# Altium schematic sheet 05 Flash.SchDoc
size 420 x 297 mm
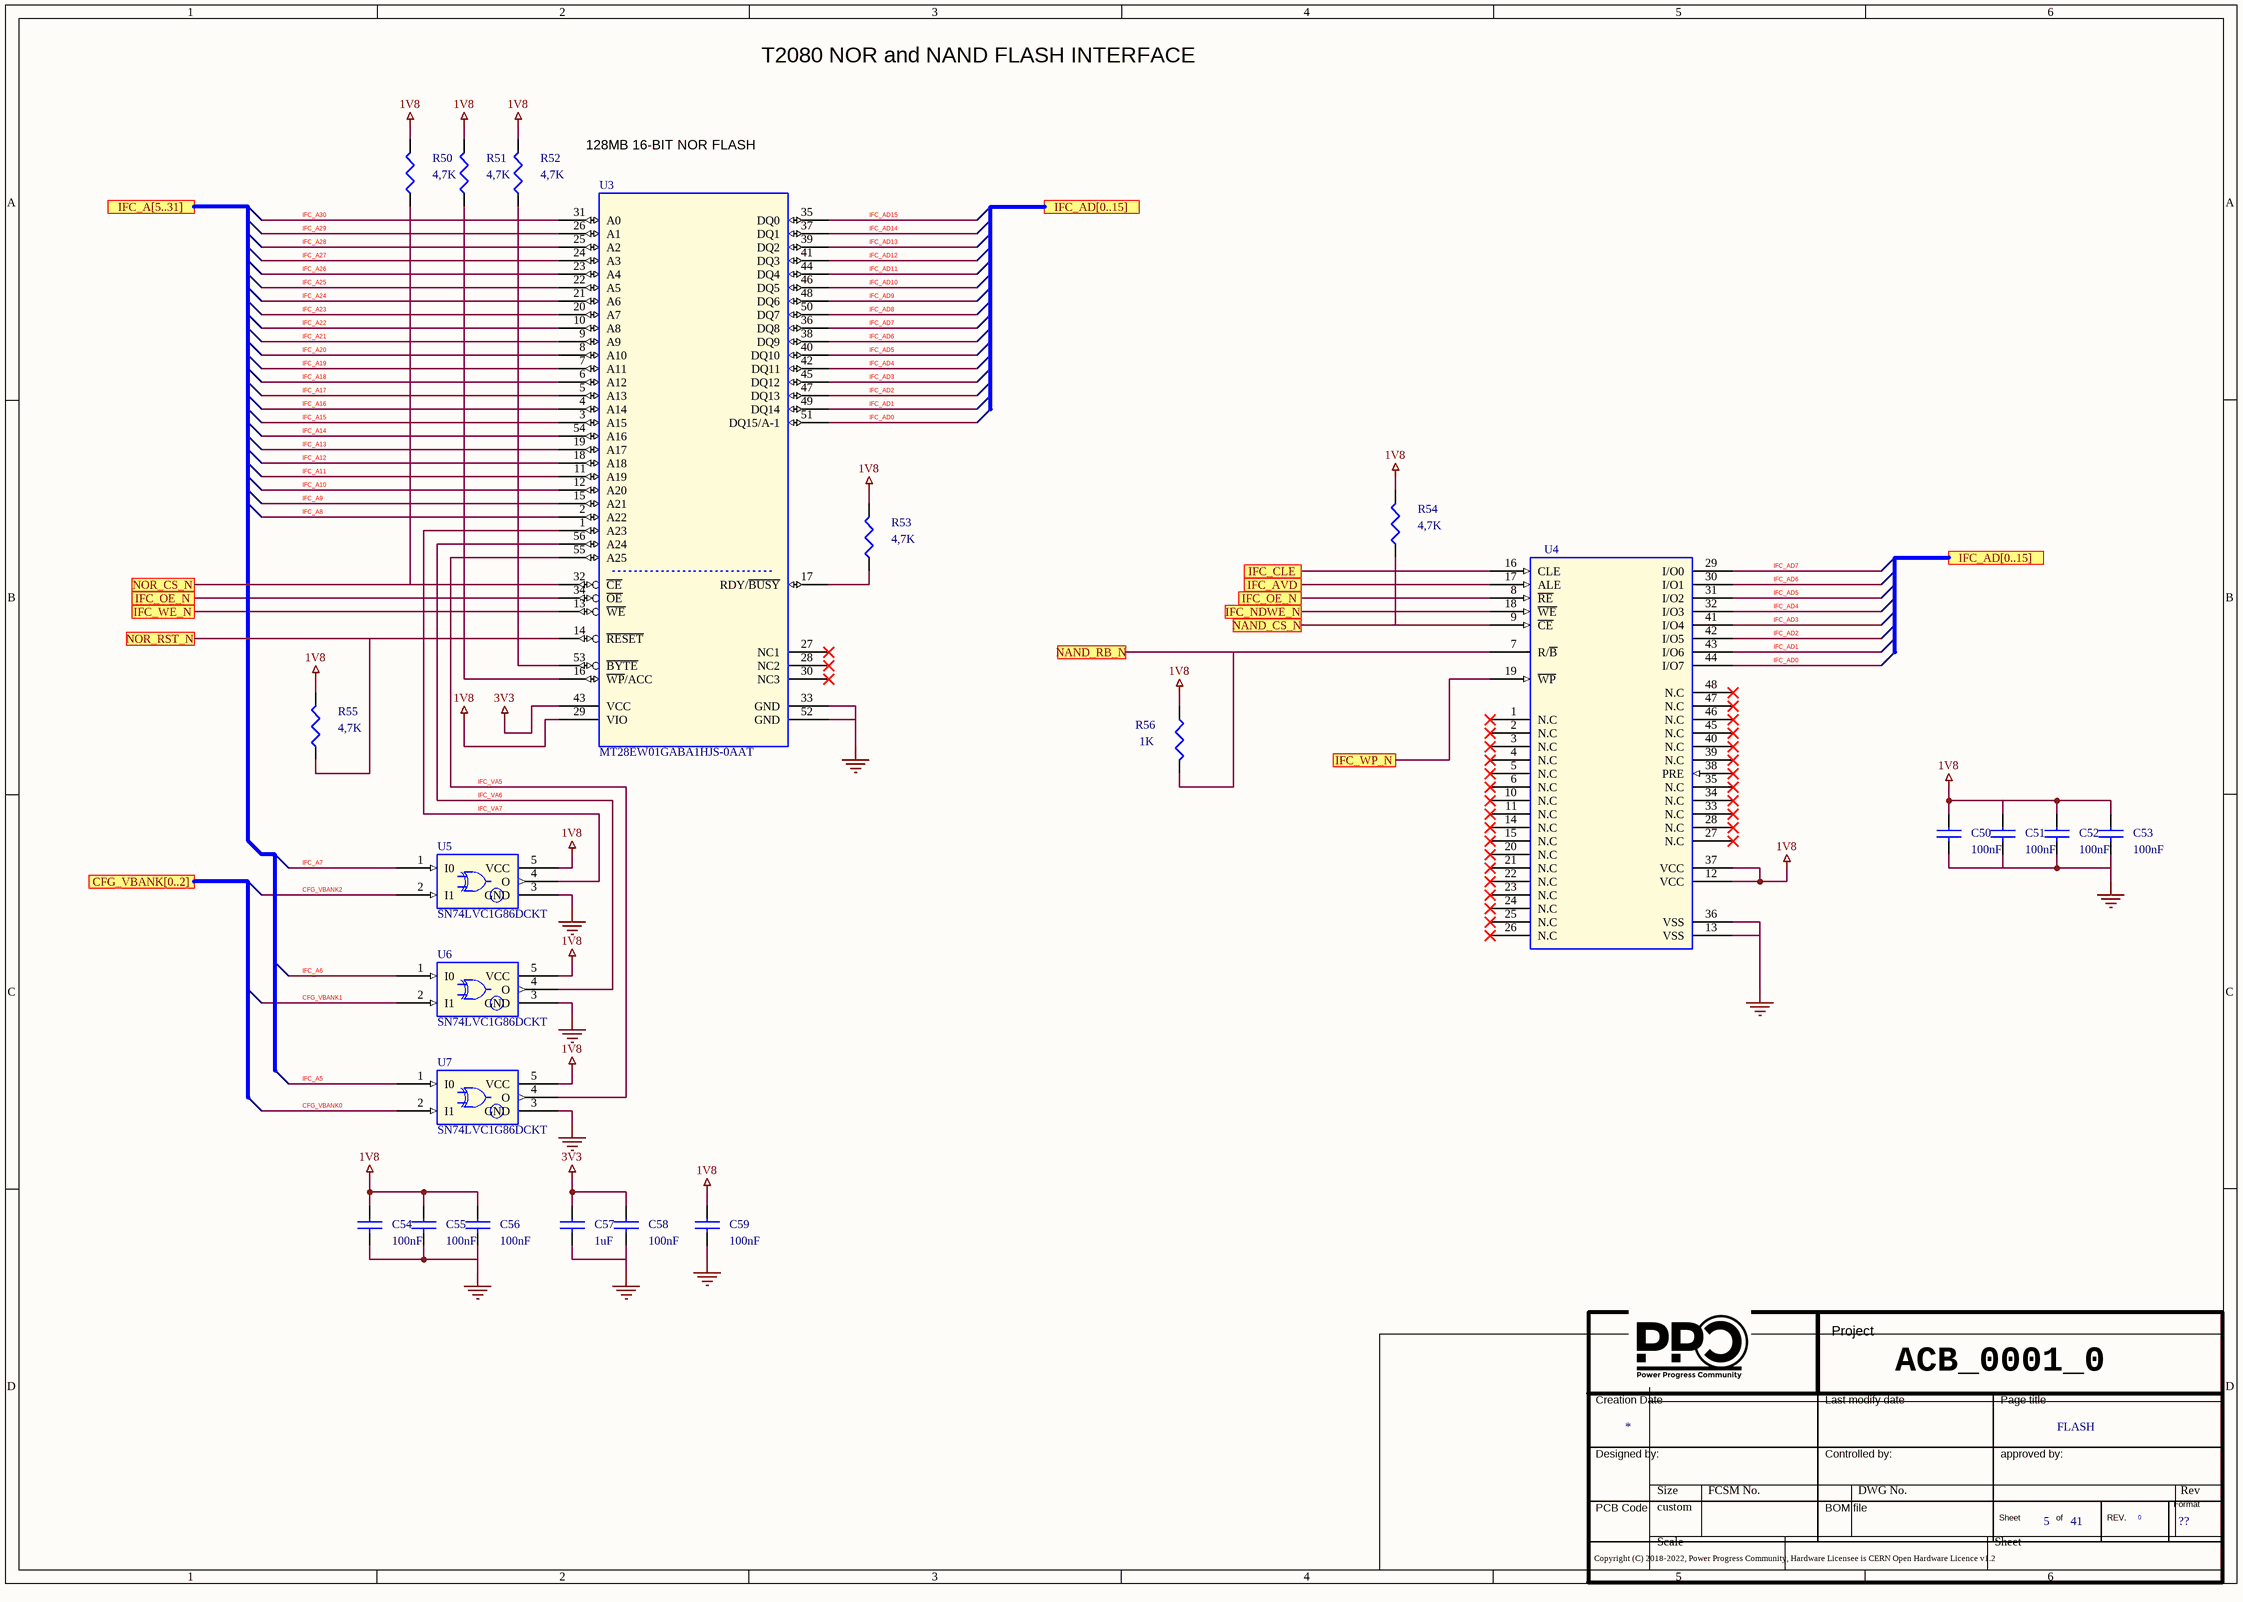
[diagram p0: 05 Flash.SchDoc]

## Parts
*  Doc: FLASH  Page Count: 41  Page Number: 5  Page Size: ??  RevCode: 0  (hidden comment: Title_block_PPC)  (graphical)
C50  100nF  [SMD_0402]
C51  100nF  [SMD_0402]
C52  100nF  [SMD_0402]
C53  100nF  [SMD_0402]
C54  100nF  [SMD_0402]
C55  100nF  [SMD_0402]
C56  100nF  [SMD_0402]
C57  1uF  [SMD_0402]
C58  100nF  [SMD_0402]
C59  100nF  [SMD_0402]
R50  4,7K  [SMD_0402]
R51  4,7K  [SMD_0402]
R52  4,7K  [SMD_0402]
R53  4,7K  [SMD_0402]
R54  4,7K  [SMD_0402]
R55  4,7K  [SMD_0402]
R56  1K  [SMD_0402]
U3  MT28EW01GABA1HJS-0AAT  [tsop1_56]
U4  MT29F4G08ABADAWP-IT:D  [TSOP_48]  (value not drawn)
U5  SN74LVC1G86DCKT  [sc70_5]
U6  SN74LVC1G86DCKT  [sc70_5]
U7  SN74LVC1G86DCKT  [sc70_5]

## Ports
CFG_VBANK[0..2], IFC_A[5..31], IFC_AD[0..15], IFC_AVD, IFC_CLE, IFC_NDWE_N, IFC_OE_N, IFC_WE_N, IFC_WP_N, NAND_CS_N, NAND_RB_N, NOR_CS_N, NOR_RST_N

## Nets
1V8: C50.1 C51.1 C52.1 C53.1 C54.1 C55.1 C56.1 C59.1 R50.2 R51.2 R52.2 R53.2 R54.2 R55.2 R56.2 U3.29(VIO) U4.12(VCC) U4.37(VCC) U5.5(VCC) U6.5(VCC) U7.5(VCC)
3V3: C57.1 C58.1 U3.43(VCC)
GND: C50.2 C51.2 C52.2 C53.2 C54.2 C55.2 C56.2 C57.2 C58.2 C59.2 U3.33(GND) U3.52(GND) U4.13(VSS) U4.36(VSS) U5.3(GND) U6.3(GND) U7.3(GND)
CFG_VBANK0: U7.2(I1)
CFG_VBANK1: U6.2(I1)
CFG_VBANK2: U5.2(I1)
IFC_A5: U7.1(I0)
IFC_A6: U6.1(I0)
IFC_A7: U5.1(I0)
IFC_A8: U3.2(A22)
IFC_A9: U3.15(A21)
IFC_A10: U3.12(A20)
IFC_A11: U3.11(A19)
IFC_A12: U3.18(A18)
IFC_A13: U3.19(A17)
IFC_A14: U3.54(A16)
IFC_A15: U3.3(A15)
IFC_A16: U3.4(A14)
IFC_A17: U3.5(A13)
IFC_A18: U3.6(A12)
IFC_A19: U3.7(A11)
IFC_A20: U3.8(A10)
IFC_A21: U3.9(A9)
IFC_A22: U3.10(A8)
IFC_A23: U3.20(A7)
IFC_A24: U3.21(A6)
IFC_A25: U3.22(A5)
IFC_A26: U3.23(A4)
IFC_A27: U3.24(A3)
IFC_A28: U3.25(A2)
IFC_A29: U3.26(A1)
IFC_A30: U3.31(A0)
IFC_AD0: U3.51(DQ15/A-1) U4.44(I/O7)
IFC_AD1: U3.49(DQ14) U4.43(I/O6)
IFC_AD2: U3.47(DQ13) U4.42(I/O5)
IFC_AD3: U3.45(DQ12) U4.41(I/O4)
IFC_AD4: U3.42(DQ11) U4.32(I/O3)
IFC_AD5: U3.40(DQ10) U4.31(I/O2)
IFC_AD6: U3.38(DQ9) U4.30(I/O1)
IFC_AD7: U3.36(DQ8) U4.29(I/O0)
IFC_AD8: U3.50(DQ7)
IFC_AD9: U3.48(DQ6)
IFC_AD10: U3.46(DQ5)
IFC_AD11: U3.44(DQ4)
IFC_AD12: U3.41(DQ3)
IFC_AD13: U3.39(DQ2)
IFC_AD14: U3.37(DQ1)
IFC_AD15: U3.35(DQ0)
IFC_AVD: U4.17(ALE) ; port IFC_AVD
IFC_CLE: U4.16(CLE) ; port IFC_CLE
IFC_NDWE_N: U4.18(~{WE}) ; port IFC_NDWE_N
IFC_OE_N: U3.34(~{OE}) U4.8(~{RE}) ; port IFC_OE_N
IFC_VA5: U3.55(A25) U7.4(O)
IFC_VA6: U3.56(A24) U6.4(O)
IFC_VA7: U3.1(A23) U5.4(O)
IFC_WE_N: U3.13(~{WE}) ; port IFC_WE_N
IFC_WP_N: U4.19(~{WP}) ; port IFC_WP_N
NAND_CS_N: R54.1 U4.9(~{CE}) ; port NAND_CS_N
NAND_RB_N: R56.1 U4.7(R/~{B}) ; port NAND_RB_N
NOR_CS_N: R50.1 U3.32(~{CE}) ; port NOR_CS_N
NOR_RST_N: R55.1 U3.14(~{RESET}) ; port NOR_RST_N
NetR51_1: R51.1 U3.16(~{WP}/ACC)
NetR52_1: R52.1 U3.53(~{BYTE})
NetR53_1: R53.1 U3.17(RDY/~{BUSY})

Not connected (* = marked no-connect by the designer): U3 27(NC1)* 28(NC2)* 30(NC3)*; U4 1(N.C)* 2(N.C)* 3(N.C)* 4(N.C)* 5(N.C)* 6(N.C)* 10(N.C)* 11(N.C)* 14(N.C)* 15(N.C)* 20(N.C)* 21(N.C)* 22(N.C)* 23(N.C)* 24(N.C)* 25(N.C)* 26(N.C)* 27(N.C)* 28(N.C)* 33(N.C)* 34(N.C)* 35(N.C)* 38(PRE)* 39(N.C)* 40(N.C)* 45(N.C)* 46(N.C)* 47(N.C)* 48(N.C)*

## Notes on the sheet
- T2080 NOR and NAND FLASH INTERFACE
- 128MB 16-BIT NOR FLASH
- ACB_0001_0
- (in symbol Title_block_PPC) Project; Creation Date; Last modify date; Page title; Designed by:; Controlled by:; approved by:; Format; PCB Code; BOM file; Sheet; of; REV.; Copyright (C) 2018-2022, Power Progress Community, Hardware Licensee is CERN Open Hardware Licence v1.2

## Library data of the parts
* = Title_block_PPC: Title: T2080PCIe; Author: MICETEK; Page Create Date: March  8, 1995; Page Title: ?; Page Modify Date: *
C50-C56 C58 C59 = CAP NP_Dup3: COND.CER. 100NF 50V 0402 X7R SMD; Part Number: PASSIVE_24; Manufacturer 1: TDK; Manufacturer Part Number 1: CGA2B3X7R1H104M050BD; RSM: RC0402; Part Type: Capacitors\Ceramic\SMD\0402; PCB Footprint: SMD_0402
C57 = CAP NP_Dup3: CAP CER 1UF 25V X6S 0402; Part Number: PASSIVE_1446; Manufacturer 1: Murata; Manufacturer Part Number 1: GRM155C81E105KE11D; RSM: RC0402; Part Type: Capacitors\Ceramic\SMD\0402; PCB Footprint: SMD_0402
R50-R55 = R_Dup6: RESIS.CHIP 4,7K 5% 0402 SMD; Manufacturer 1: ROYAL OHM; Part Number: PASSIVE_861; RSM: RC0402; Manufacturer Part Number 1: RESIS.CHIP 4,7K 5% 0402 SMD; Part Type: Resistors\Fixed\SMD\0402\5%; PCB Footprint: SMD_0402
R56 = R_Dup6: RESIS.CHIP 1K 1% 0402 SMD; Part Number: PASSIVE_628; Manufacturer 1: ROYAL OHM; RSM: RC0402; Part Type: Resistors\Fixed\SMD\0402\1%; Manufacturer Part Number 1: RESIS.CHIP 1K 1% 0402 SMD; PCB Footprint: SMD_0402
U3 = FLASH-NOR-64Mx16: NOR Flash EW-SERIES FLASH NOR SLC 64MX16 TSOP; MPN: JS28F00AM29EWHA; Part Number: MEMORIES_103; Vendor: Micron; PCB Footprint: TSOP-56; TYPE: IC; Part Type: FLASH; Manufacturer 1: Micron; Manufacturer Part Number 1: MT28EW01GABA1HJS-0AAT; Distributor 1: MOUSER(340-279939-TRAY); RSM: TSOP-56
U4 = K9F2G08U0M-PCB0: IC NAND FLASH 4GB 3.3V 48-TSOP LONGEVITY; Part Number: MEMORIES_36; Manufacturer 1: Micron; RSM: TSOP-48; PCB Footprint: TSOP_48; Part Type: FLASH; Manufacturer Part Number 1: MT29F4G08ABADAWP-IT:D; Distributor 1: AVNET EXPRESS
U5-U7 = 74LVC1G86: Porte logiche SNGL 2 Input Exclusive OR Gate; Manufacturer 1: TEXAS; Part Number: LOGIC_348; MPN: SN74LVC1G86DCKR; PCB Footprint: sc70-5; Vendor: TI; RSM: SC-70-5; Distributor 1: MOUSER(595-SN74LVC1G86DCKT); Manufacturer Part Number 1: SN74LVC1G86DCKT; Part Type: LVC\SINGLE GATE; TYPE: IC